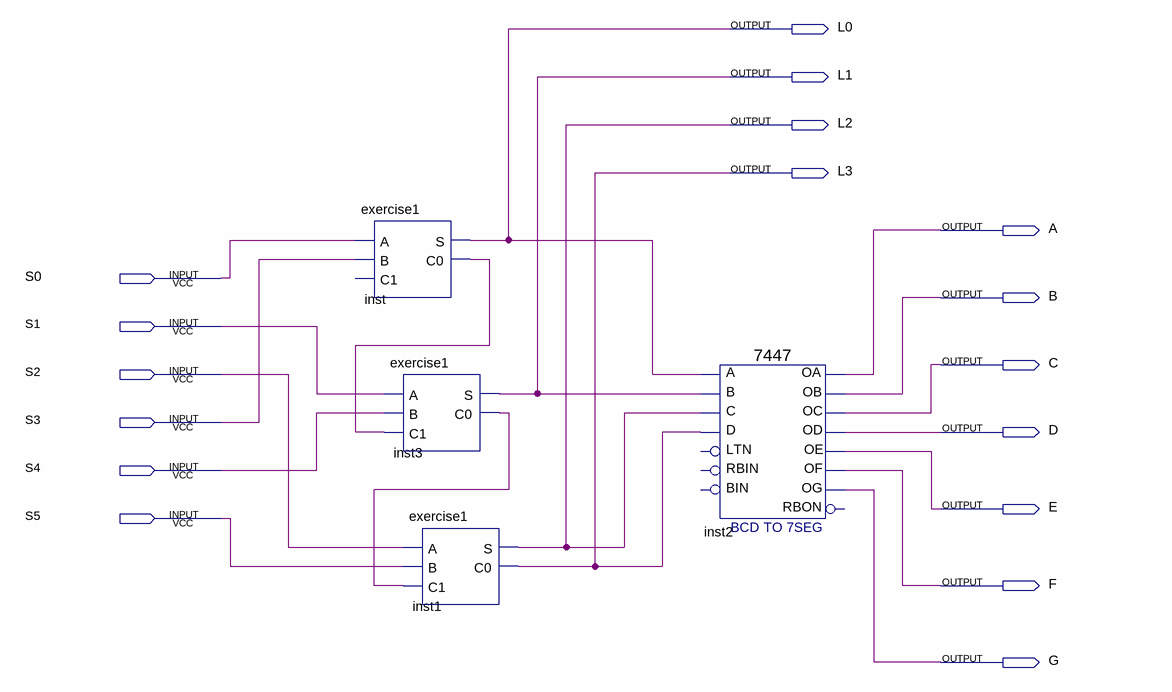
[diagram p0: schematic sheet]
// Quartus schematic exercise1.bdf as structural Verilog: 4 symbols, 17 pins
module exercise1 (
  input  S0,
  input  S1,
  input  S2,
  input  S3,
  input  S4,
  input  S5,
  output L0,
  output L1,
  output L2,
  output L3,
  output A,
  output B,
  output C,
  output D,
  output E,
  output F,
  output G
);

  wire inst3_c0, inst_c0;

  exercise1 inst (.A(S0), .B(S3), .S(L0), .C0(inst_c0));  // open: C1
  exercise1 inst3 (.A(S1), .B(S4), .C1(inst_c0), .S(L1), .C0(inst3_c0));
  exercise1 inst1 (.A(S2), .B(S5), .C1(inst3_c0), .S(L2), .C0(L3));
  \7447  inst2 (
    .B(L1), .C(L2), .D(L3), .A(L0), .OB(B), .OC(C), .OE(E), .OD(D), .OF(F), .OG(G), .OA(A));  // open: LTN, RBIN, BIN, RBON
endmodule
